# EAGLE design vfd_controller (EAGLE 9.2.2)

## Sheet 1 of 3
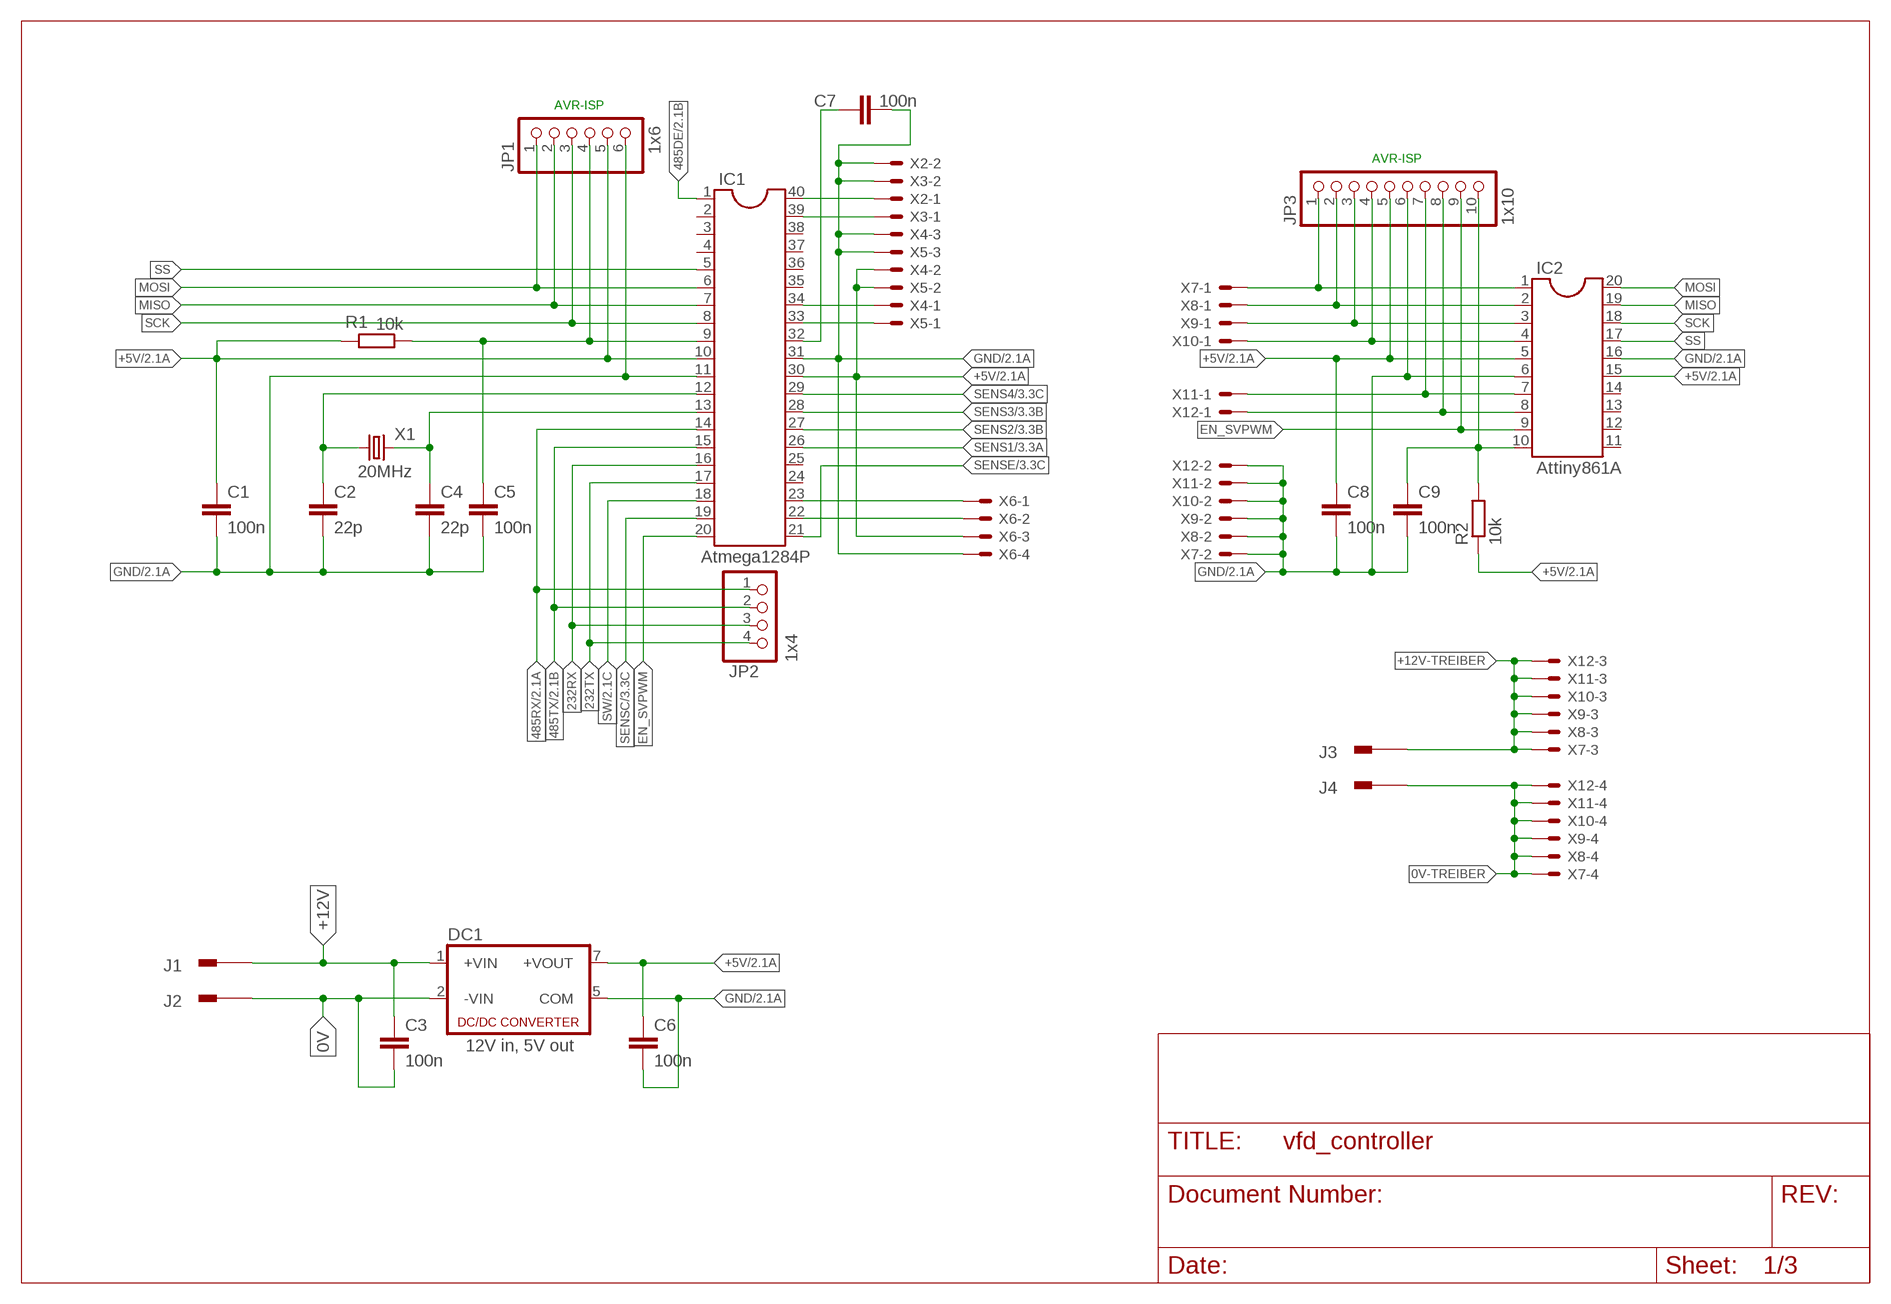
[diagram p0: schematic, sheet 1]

### Parts
C1  100n  C-EU025-024X044  [C025-024X044]
C2  22p  C-EU025-024X044  [C025-024X044]
C3  100n  C-EU025-024X044  [C025-024X044]
C4  22p  C-EU025-024X044  [C025-024X044]
C5  100n  C-EU050-025X075  [C050-025X075]
C6  100n  C-EU050-025X075  [C050-025X075]
C7  100n  C-EU025-024X044  [C025-024X044]
C8  100n  C-EU025-024X044  [C025-024X044]
C9  100n  C-EU025-024X044  [C025-024X044]
DC1  12V in, 5V out  MEV  [MEV]
IC1  Atmega1284P  DIL40  [DIL40]
IC2  Attiny861A  DIL20  [DIL20]
J1  PIN2F061.200  [F061.200]
J2  PIN2F061.200  [F061.200]
J3  PIN2F061.200  [F061.200]
J4  PIN2F061.200  [F061.200]
JP1  1x6  PINHD-1X6  [1X06]
JP2  1x4  PINHD-1X4  [1X04]
JP3  1x10  PINHD-1X10  [1X10]
R1  10k  R-EU_0204/2V  [0204V]
R2  10k  R-EU_0207/12  [0207/12]
X1  20MHz  CRYSTALS-NOGND-HC49  [HC49]
X2  JST-XH-02-PIN-LONG-PAD  [JST-XH-02-PACKAGE-LONG-PAD]
X3  JST-XH-02-PIN-LONG-PAD  [JST-XH-02-PACKAGE-LONG-PAD]
X4  JST-XH-03-PIN-LONG-PAD  [JST-XH-03-PACKAGE-LONG-PAD]
X5  JST-XH-03-PIN-LONG-PAD  [JST-XH-03-PACKAGE-LONG-PAD]
X6  JST-XH-04-PIN-LONG-PAD  [JST-XH-04-PACKAGE-LONG-PAD]
X7  JST-XH-04-PIN-LONG-PAD  [JST-XH-04-PACKAGE-LONG-PAD]
X8  JST-XH-04-PIN-LONG-PAD  [JST-XH-04-PACKAGE-LONG-PAD]
X9  JST-XH-04-PIN-LONG-PAD  [JST-XH-04-PACKAGE-LONG-PAD]
X10  JST-XH-04-PIN-LONG-PAD  [JST-XH-04-PACKAGE-LONG-PAD]
X11  JST-XH-04-PIN-LONG-PAD  [JST-XH-04-PACKAGE-LONG-PAD]
X12  JST-XH-04-PIN-LONG-PAD  [JST-XH-04-PACKAGE-LONG-PAD]

### Nets
0V: C3.2 DC1.2(-VIN) J2.1A J2.1B
0V-TREIBER: J4.1A J4.1B X7.4 X8.4 X9.4 X10.4 X11.4 X12.4
232RX: IC1.16 JP2.3
232TX: IC1.17 JP2.4
485DE: IC1.1 ; also sheet 2
485RX: IC1.14 JP2.1 ; also sheet 2
485TX: IC1.15 JP2.2 ; also sheet 2
+5V: C1.1 C6.1 C8.1 DC1.7(+VOUT) IC1.10 IC1.30 IC2.5 IC2.15 JP1.5 JP3.5 R1.2 R2.1 X4.2 X5.2 X6.3 ; also sheet 2,3
+12V: C3.1 DC1.1(+VIN) J1.1A J1.1B
+12V-TREIBER: J3.1A J3.1B X7.3 X8.3 X9.3 X10.3 X11.3 X12.3
EN_SVPWM: IC1.20 IC2.9 JP3.9
GND: C1.2 C2.2 C4.2 C5.2 C6.2 C7.2 C8.2 C9.2 DC1.5(COM) IC1.11 IC1.31 IC2.6 IC2.16 JP1.6 JP3.6 X2.2 X3.2 X4.3 X5.3 X6.4 X7.2 X8.2 X9.2 X10.2 X11.2 X12.2 ; also sheet 2,3
H1: IC2.1 JP3.1 X7.1
H2: IC2.3 JP3.3 X9.1
H3: IC2.7 JP3.7 X11.1
L1: IC2.2 JP3.2 X8.1
L2: IC2.4 JP3.4 X10.1
L3: IC2.8 JP3.8 X12.1
MISO: IC1.7 IC2.19 JP1.2
MOSI: IC1.6 IC2.20 JP1.1
N$2: IC1.23 X6.1
N$3: IC1.22 X6.2
N$7: IC1.33 X5.1
N$15: IC1.34 X4.1
N$16: C7.1 IC1.32
N$23: IC1.39 X3.1
N$24: IC1.40 X2.1
N$37: C9.1 IC2.10 JP3.10 R2.2
N$41: C5.1 IC1.9 JP1.4 R1.1
N$43: C2.1 IC1.12 X1.1
N$44: C4.1 IC1.13 X1.2
SCK: IC1.8 IC2.18 JP1.3
SENS1: IC1.26 ; also sheet 3
SENS2: IC1.27 ; also sheet 3
SENS3: IC1.28 ; also sheet 3
SENS4: IC1.29 ; also sheet 3
SENSC: IC1.19 ; also sheet 3
SENSE: IC1.21 ; also sheet 3
SS: IC1.5 IC2.17
SW: IC1.18 ; also sheet 2
Unconnected: IC1.2 IC1.3 IC1.4 IC1.24 IC1.25 IC1.35 IC1.36 IC1.37 IC1.38 IC2.11 IC2.12 IC2.13 IC2.14

### Notes on the sheet
- AVR-ISP
- AVR-ISP

## Sheet 2 of 3
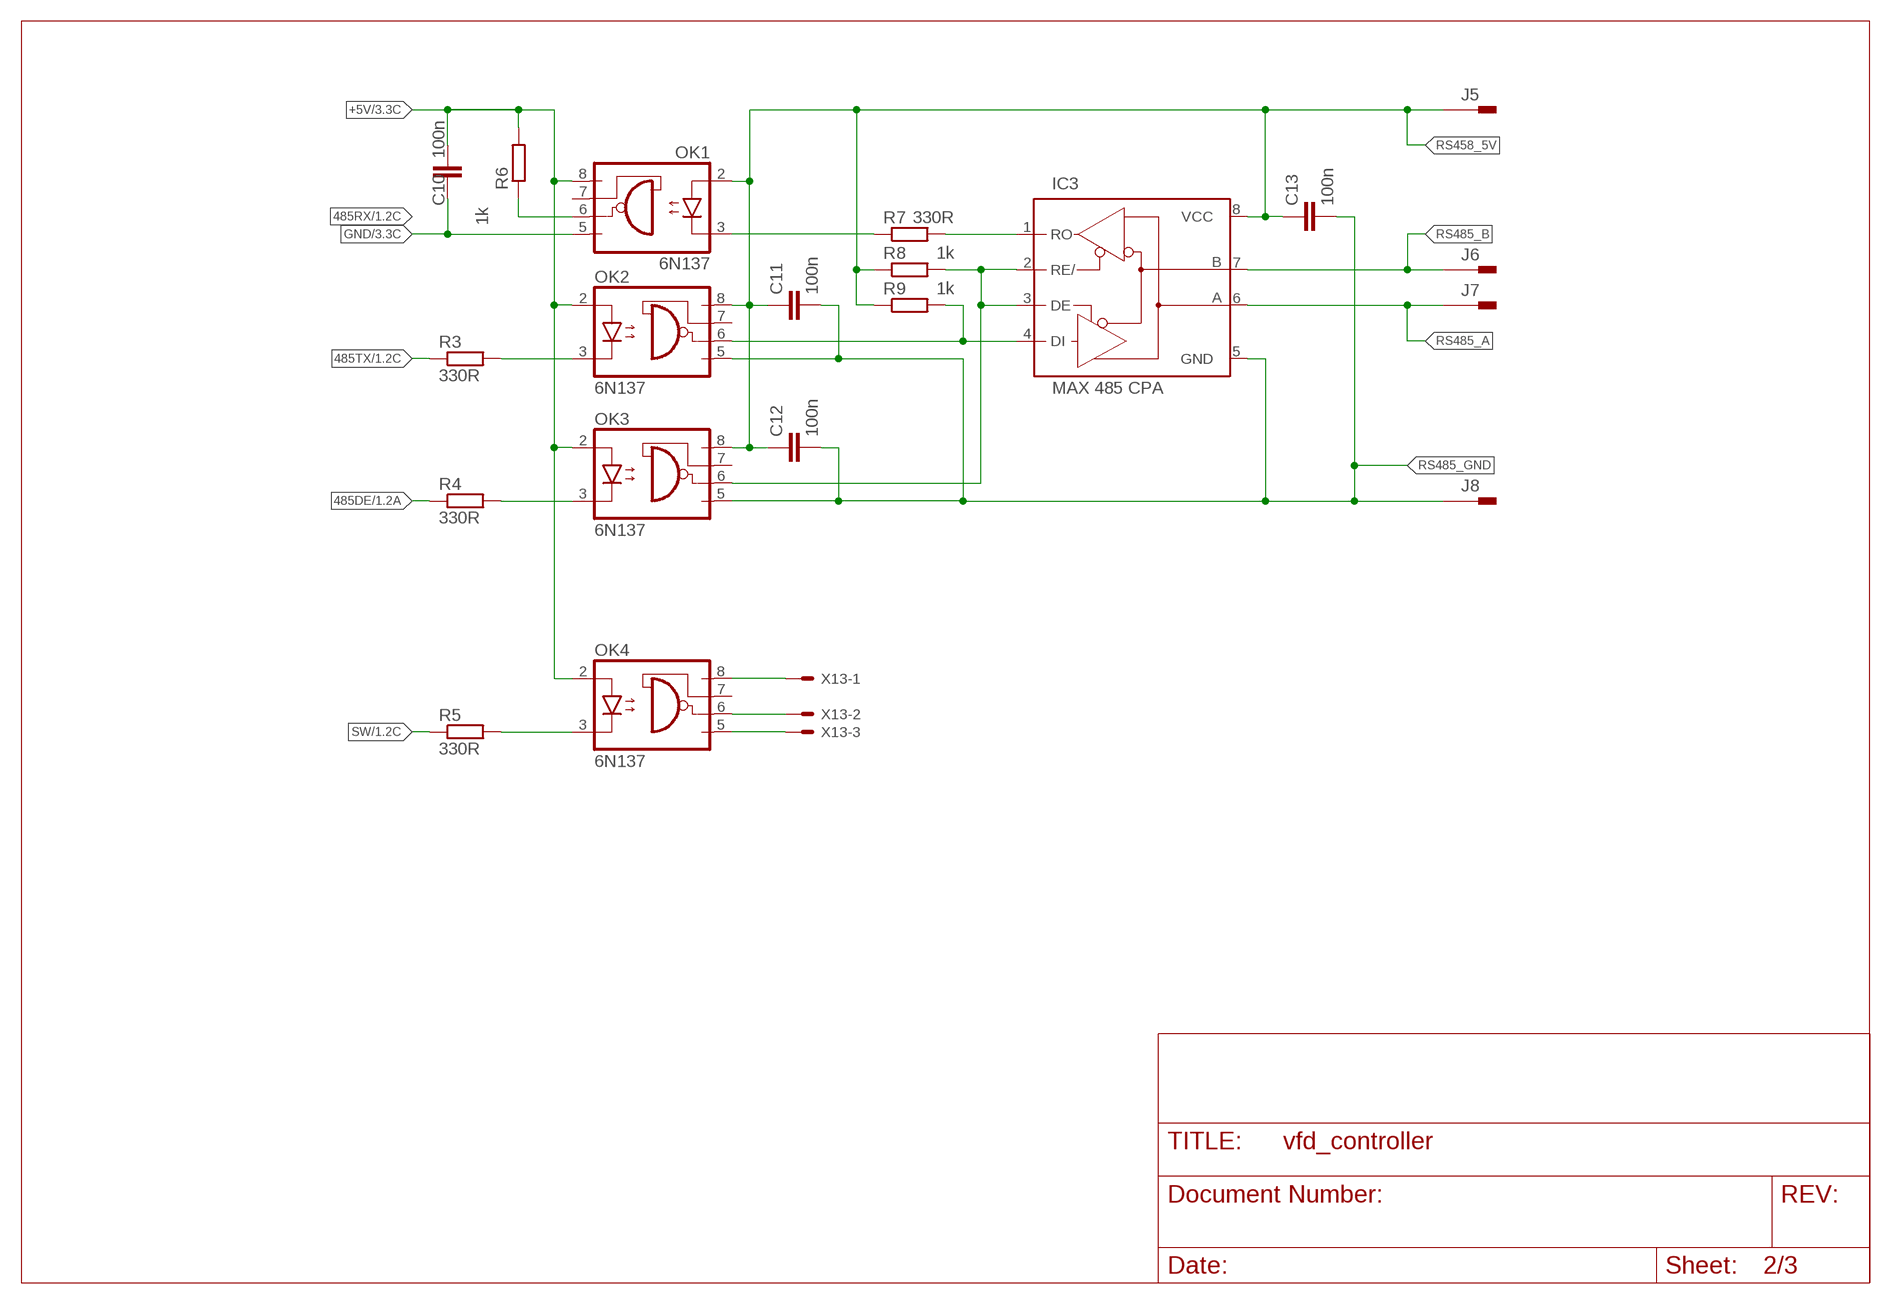
[diagram p1: schematic, sheet 2]

### Parts
C10  100n  C-EU025-024X044  [C025-024X044]
C11  100n  C-EU025-024X044  [C025-024X044]
C12  100n  C-EU025-024X044  [C025-024X044]
C13  100n  C-EU025-024X044  [C025-024X044]
IC3  MAX 485 CPA  MAX3468CPA  [DIL08]
J5  PIN2F061.200  [F061.200]
J6  PIN2F061.200  [F061.200]
J7  PIN2F061.200  [F061.200]
J8  PIN2F061.200  [F061.200]
OK1  6N137  [DIL08]
OK2  6N137  [DIL08]
OK3  6N137  [DIL08]
OK4  6N137  [DIL08]
R3  330R  R-EU_0204/7  [0204/7]
R4  330R  R-EU_0204/7  [0204/7]
R5  330R  R-EU_0207/12  [0207/12]
R6  1k  R-EU_0204/5  [0204/5]
R7  330R  R-EU_0204/5  [0204/5]
R8  1k  R-EU_0204/5  [0204/5]
R9  1k  R-EU_0204/5  [0204/5]
X13  JST-XH-03-PIN-LONG-PAD  [JST-XH-03-PACKAGE-LONG-PAD]

### Nets
485DE: R4.1 ; also sheet 1
485RX: OK1.6(VO) R6.1 ; also sheet 1
485TX: R3.1 ; also sheet 1
+5V: C10.2 OK1.8(VCC) OK2.2(A) OK3.2(A) OK4.2(A) R6.2 ; also sheet 1,3
GND: C10.1 OK1.5(GND) ; also sheet 1,3
N$6: IC3.2(RE/) IC3.3(DE) OK3.6(VO) R8.2
N$8: IC3.1(RO) R7.2
N$9: OK1.3(C) R7.1
N$10: IC3.4(DI) OK2.6(VO) R9.2
N$11: OK3.3(C) R4.2
N$12: OK2.3(C) R3.2
N$33: OK4.3(C) R5.2
N$39: OK4.5(GND) X13.3
N$40: OK4.6(VO) X13.2
N$42: OK4.8(VCC) X13.1
RS458_5V: C11.1 C12.1 C13.1 IC3.8(VCC) J5.1A J5.1B OK1.2(A) OK2.8(VCC) OK3.8(VCC) R8.1 R9.1
RS485_A: IC3.6(A) J7.1A J7.1B
RS485_B: IC3.7(B) J6.1A J6.1B
RS485_GND: C11.2 C12.2 C13.2 IC3.5(GND) J8.1A J8.1B OK2.5(GND) OK3.5(GND)
SW: R5.1 ; also sheet 1
Unconnected: OK1.7(VE) OK2.7(VE) OK3.7(VE) OK4.7(VE)

## Sheet 3 of 3
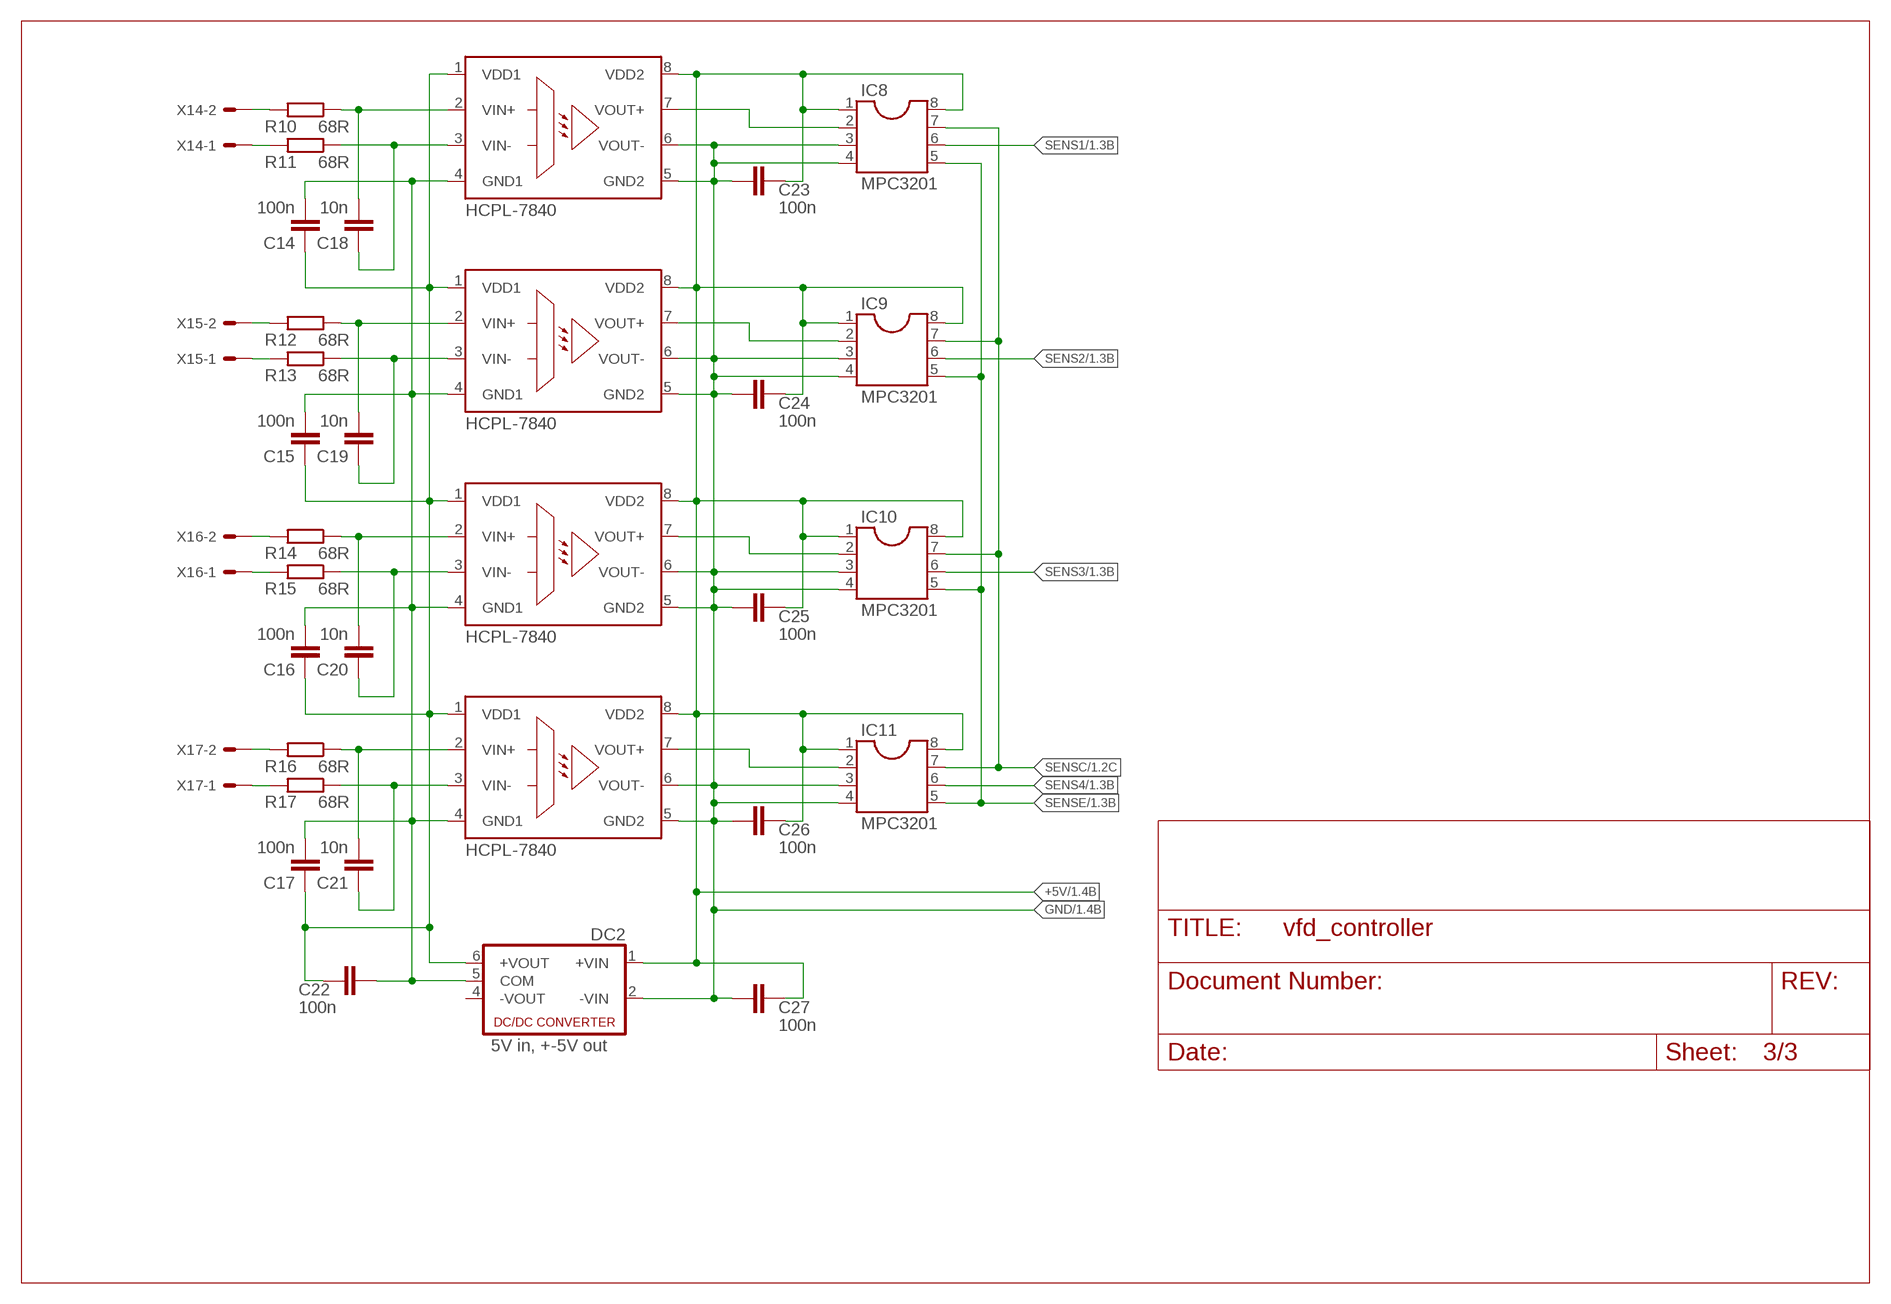
[diagram p2: schematic, sheet 3]

### Parts
C14  100n  C-EU025-024X044  [C025-024X044]
C15  100n  C-EU050-025X075  [C050-025X075]
C16  100n  C-EU050-025X075  [C050-025X075]
C17  100n  C-EU050-025X075  [C050-025X075]
C18  10n  C-EU025-024X044  [C025-024X044]
C19  10n  C-EU025-024X044  [C025-024X044]
C20  10n  C-EU025-024X044  [C025-024X044]
C21  10n  C-EU025-024X044  [C025-024X044]
C22  100n  C-EU025-024X044  [C025-024X044]
C23  100n  C-EU025-024X044  [C025-024X044]
C24  100n  C-EU050-025X075  [C050-025X075]
C25  100n  C-EU050-025X075  [C050-025X075]
C26  100n  C-EU050-025X075  [C050-025X075]
C27  100n  C-EU025-024X044  [C025-024X044]
DC2  5V in, +-5V out  NMA  [NMA]
IC4  HCPL-7840  HCPL-7800  [DIL08]
IC5  HCPL-7840  HCPL-7800  [DIL08]
IC6  HCPL-7840  HCPL-7800  [DIL08]
IC7  HCPL-7840  HCPL-7800  [DIL08]
IC8  MPC3201  DIL8  [DIL08]
IC9  MPC3201  DIL8  [DIL08]
IC10  MPC3201  DIL8  [DIL08]
IC11  MPC3201  DIL8  [DIL08]
R10  68R  R-EU_0204/5  [0204/5]
R11  68R  R-EU_0204/5  [0204/5]
R12  68R  R-EU_0204/5  [0204/5]
R13  68R  R-EU_0204/5  [0204/5]
R14  68R  R-EU_0204/5  [0204/5]
R15  68R  R-EU_0204/5  [0204/5]
R16  68R  R-EU_0204/5  [0204/5]
R17  68R  R-EU_0204/5  [0204/5]
X14  JST-XH-02-PIN-LONG-PAD  [JST-XH-02-PACKAGE-LONG-PAD]
X15  JST-XH-02-PIN-LONG-PAD  [JST-XH-02-PACKAGE-LONG-PAD]
X16  JST-XH-02-PIN-LONG-PAD  [JST-XH-02-PACKAGE-LONG-PAD]
X17  JST-XH-02-PIN-LONG-PAD  [JST-XH-02-PACKAGE-LONG-PAD]

### Nets
+5V: C23.2 C24.2 C25.2 C26.2 C27.2 DC2.1(+VIN) IC4.8(VDD2) IC5.8(VDD2) IC6.8(VDD2) IC7.8(VDD2) IC8.1 IC8.8 IC9.1 IC9.8 IC10.1 IC10.8 IC11.1 IC11.8 ; also sheet 1,2
GND: C23.1 C24.1 C25.1 C26.1 C27.1 DC2.2(-VIN) IC4.5(GND2) IC4.6(VOUT-) IC5.5(GND2) IC5.6(VOUT-) IC6.5(GND2) IC6.6(VOUT-) IC7.5(GND2) IC7.6(VOUT-) IC8.3 IC8.4 IC9.3 IC9.4 IC10.3 IC10.4 IC11.3 IC11.4 ; also sheet 1,2
N$4: R17.2 X17.1
N$5: R16.2 X17.2
N$13: R15.2 X16.1
N$14: R14.2 X16.2
N$17: R13.2 X15.1
N$18: C14.2 C15.2 C16.2 C17.2 C22.1 DC2.5(COM) IC4.4(GND1) IC5.4(GND1) IC6.4(GND1) IC7.4(GND1)
N$19: R12.2 X15.2
N$20: C18.2 IC4.2(VIN+) R10.1
N$21: C19.2 IC5.2(VIN+) R12.1
N$22: C19.1 IC5.3(VIN-) R13.1
N$25: C20.2 IC6.2(VIN+) R14.1
N$26: C20.1 IC6.3(VIN-) R15.1
N$27: C21.2 IC7.2(VIN+) R16.1
N$28: C21.1 IC7.3(VIN-) R17.1
N$29: C14.1 C15.1 C16.1 C17.1 C22.2 DC2.6(+VOUT) IC4.1(VDD1) IC5.1(VDD1) IC6.1(VDD1) IC7.1(VDD1)
N$30: C18.1 IC4.3(VIN-) R11.1
N$31: IC4.7(VOUT+) IC8.2
N$32: IC5.7(VOUT+) IC9.2
N$34: IC6.7(VOUT+) IC10.2
N$35: IC7.7(VOUT+) IC11.2
N$36: R11.2 X14.1
N$38: R10.2 X14.2
SENS1: IC8.6 ; also sheet 1
SENS2: IC9.6 ; also sheet 1
SENS3: IC10.6 ; also sheet 1
SENS4: IC11.6 ; also sheet 1
SENSC: IC8.7 IC9.7 IC10.7 IC11.7 ; also sheet 1
SENSE: IC8.5 IC9.5 IC10.5 IC11.5 ; also sheet 1
Unconnected: DC2.4(-VOUT)

## Library data of the parts
C1 C3 C7-C9 C14 C22 C23 C27 = rcl:C-EU: CAPACITOR, European symbol; R: MKS02-63 100N; SPICEPREFIX: C
C2 C4 = rcl:C-EU: CAPACITOR, European symbol; R: KERKO 22p; SPICEPREFIX: C
C5 C6 C15-C17 C24-C26 = rcl:C-EU: CAPACITOR, European symbol; R: MKS2-63 100N; SPICEPREFIX: C
C10-C13 = resistor:C-EU: CAPACITOR, European symbol; R: MKS02-63 100N
C18-C21 = rcl:C-EU: CAPACITOR, European symbol; R: MKS02-63 10N; SPICEPREFIX: C
DC1 = custom:MEV: DC-DC CONVERTER; R: MEV1S1205SC
DC2 = dc-dc-converter:NMA: DC-DC CONVERTER; MF: C & D TECHNOLOGIES, INC; MPN: NMA0515SC; OC_FARNELL: 1021434; OC_NEWARK: 61K3064; R: MEA1D0505SC
IC1 = ic-package:DIL40: Dual In Line; R: ATMEGA 1284-P-PU
IC2 = ic-package:DIL20: Dual In Line / Socket; R: ATTINY 861A-PU
IC3 = maxim:MAX34*: +5V, Fail-Safe, 40Mbps, Profibus RS-485/RS-422 Transceivers Source: MAX3465-MAX3469.pdf; OC_FARNELL: unknown; OC_NEWARK: unknown; R: MAX 485 CPA
IC4-IC7 = avago:HCPL-7800: Isolation Amplifer Source: http://www.avagotech.com/docs/AV02-0410EN; MPN: HCPL-7800A#500; OC_FARNELL: 459446; OC_NEWARK: 05M6395
IC8-IC11 = ic-package:DIL8: Dual In Line / Socket; R: MPC 3201-CI/P
J1-J8 = con-faston:PIN2: Flachstecker Typ Tyco/Electronics/AMP TAB, FASTON Printed Circuit Board Tabs Source: http://www.buerklin.com, http://catalog.tycoelectronics.com; OC_FARNELL: unknown; OC_NEWARK: unknown; R: FS-PW-6,35
JP1 = pinhead:PINHD-1X6: PIN HEADER; R: MPE 087-1-006
JP2 = pinhead:PINHD-1X4: PIN HEADER; R: MPE 087-1-004
JP3 = pinhead:PINHD-1X10: PIN HEADER; R: MPE 087-1-010
OK1-OK4 = optocoupler:6N137: MOTOROLA OPTO COUPLER; MPN: 6N137; OC_FARNELL: 1328376; OC_NEWARK: 52M1895; R: 6N 137
R1 R2 = rcl:R-EU_: RESISTOR, European symbol; R: METALL 10,0K; SPICEPREFIX: R
R3-R5 R7 = resistor:R-EU_: RESISTOR, European symbol; R: METALL 330
R6 R8 R9 = resistor:R-EU_: RESISTOR, European symbol; R: METALL 1,00K
R10-R17 = resistor:R-EU_: RESISTOR, European symbol; R: METALL 68,0
X1 = IQD-Frequency-Products:CRYSTALS-NOGND: CRYSTALS CAN NOT GROUNDED; R: 20,0000-HC49U-S
X2 X3 X14-X17 =  JST_XH_connnectors:JST-XH-02-PIN: JST XH Connector 2 Pin Wire to board connector. Pitch: 2,54 mm, (0.100") Number of pins: 2 Created by Rembrandt Electronics www.rembrandtelectronics.com; R: JST XH2P ST
X4 X5 X13 =  JST_XH_connnectors:JST-XH-03-PIN: JST XH Connector 2 Pin Wire to board connector. Pitch: 2,54 mm, (0.100") Number of pins: 3 Created by Rembrandt Electronics www.rembrandtelectronics.com; R: JST XH3P ST
X6-X12 =  JST_XH_connnectors:JST-XH-04-PIN: JST XH Connector 2 Pin Wire to board connector. Pitch: 2,54 mm, (0.100") Number of pins: 4 Created by Rembrandt Electronics www.rembrandtelectronics.com; R: JST XH4P ST

## Board
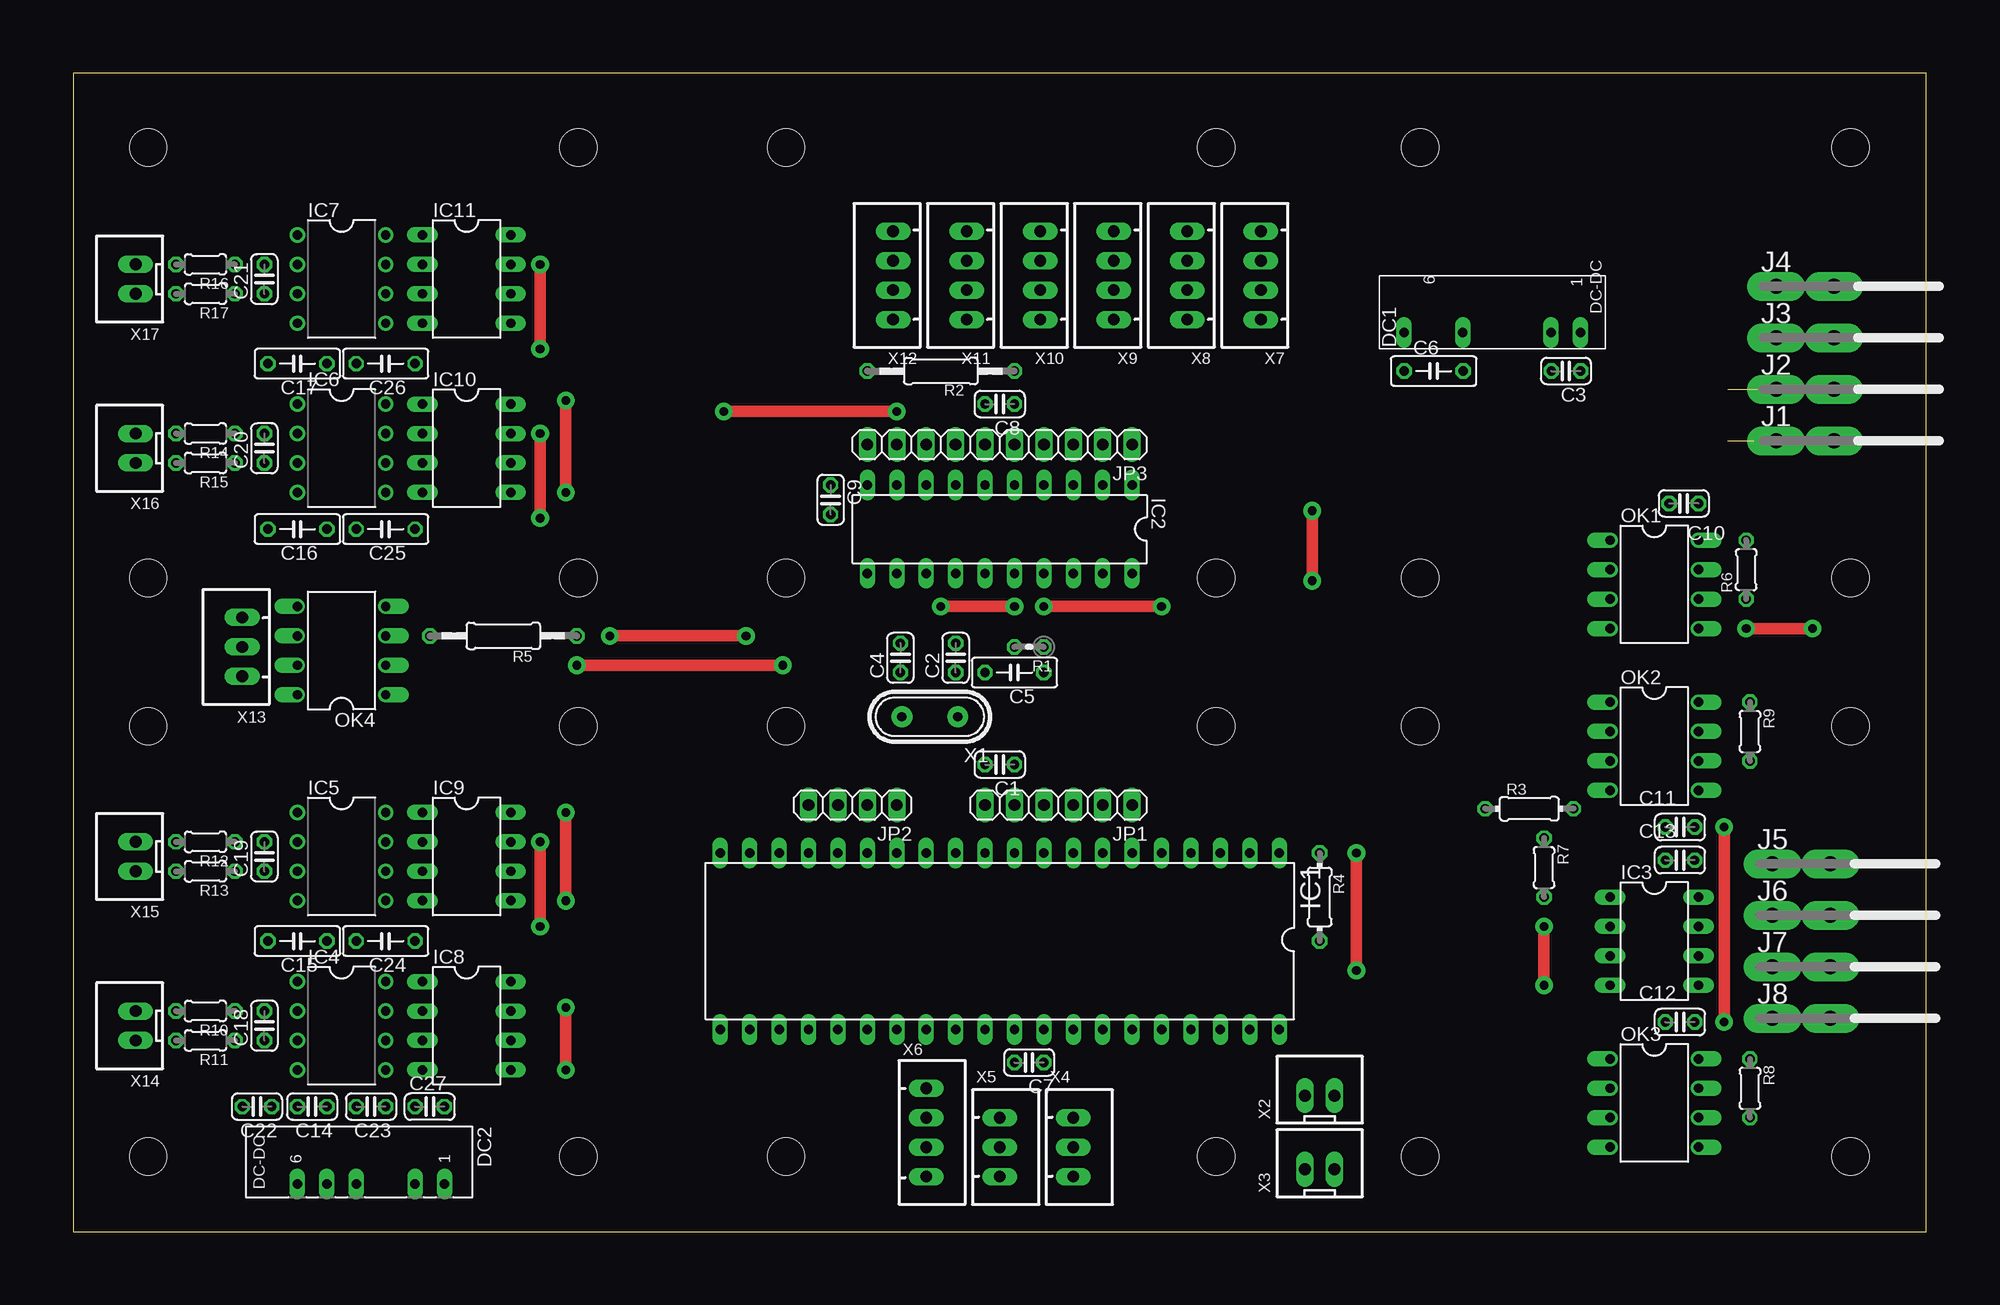
[diagram p3: board, top side]
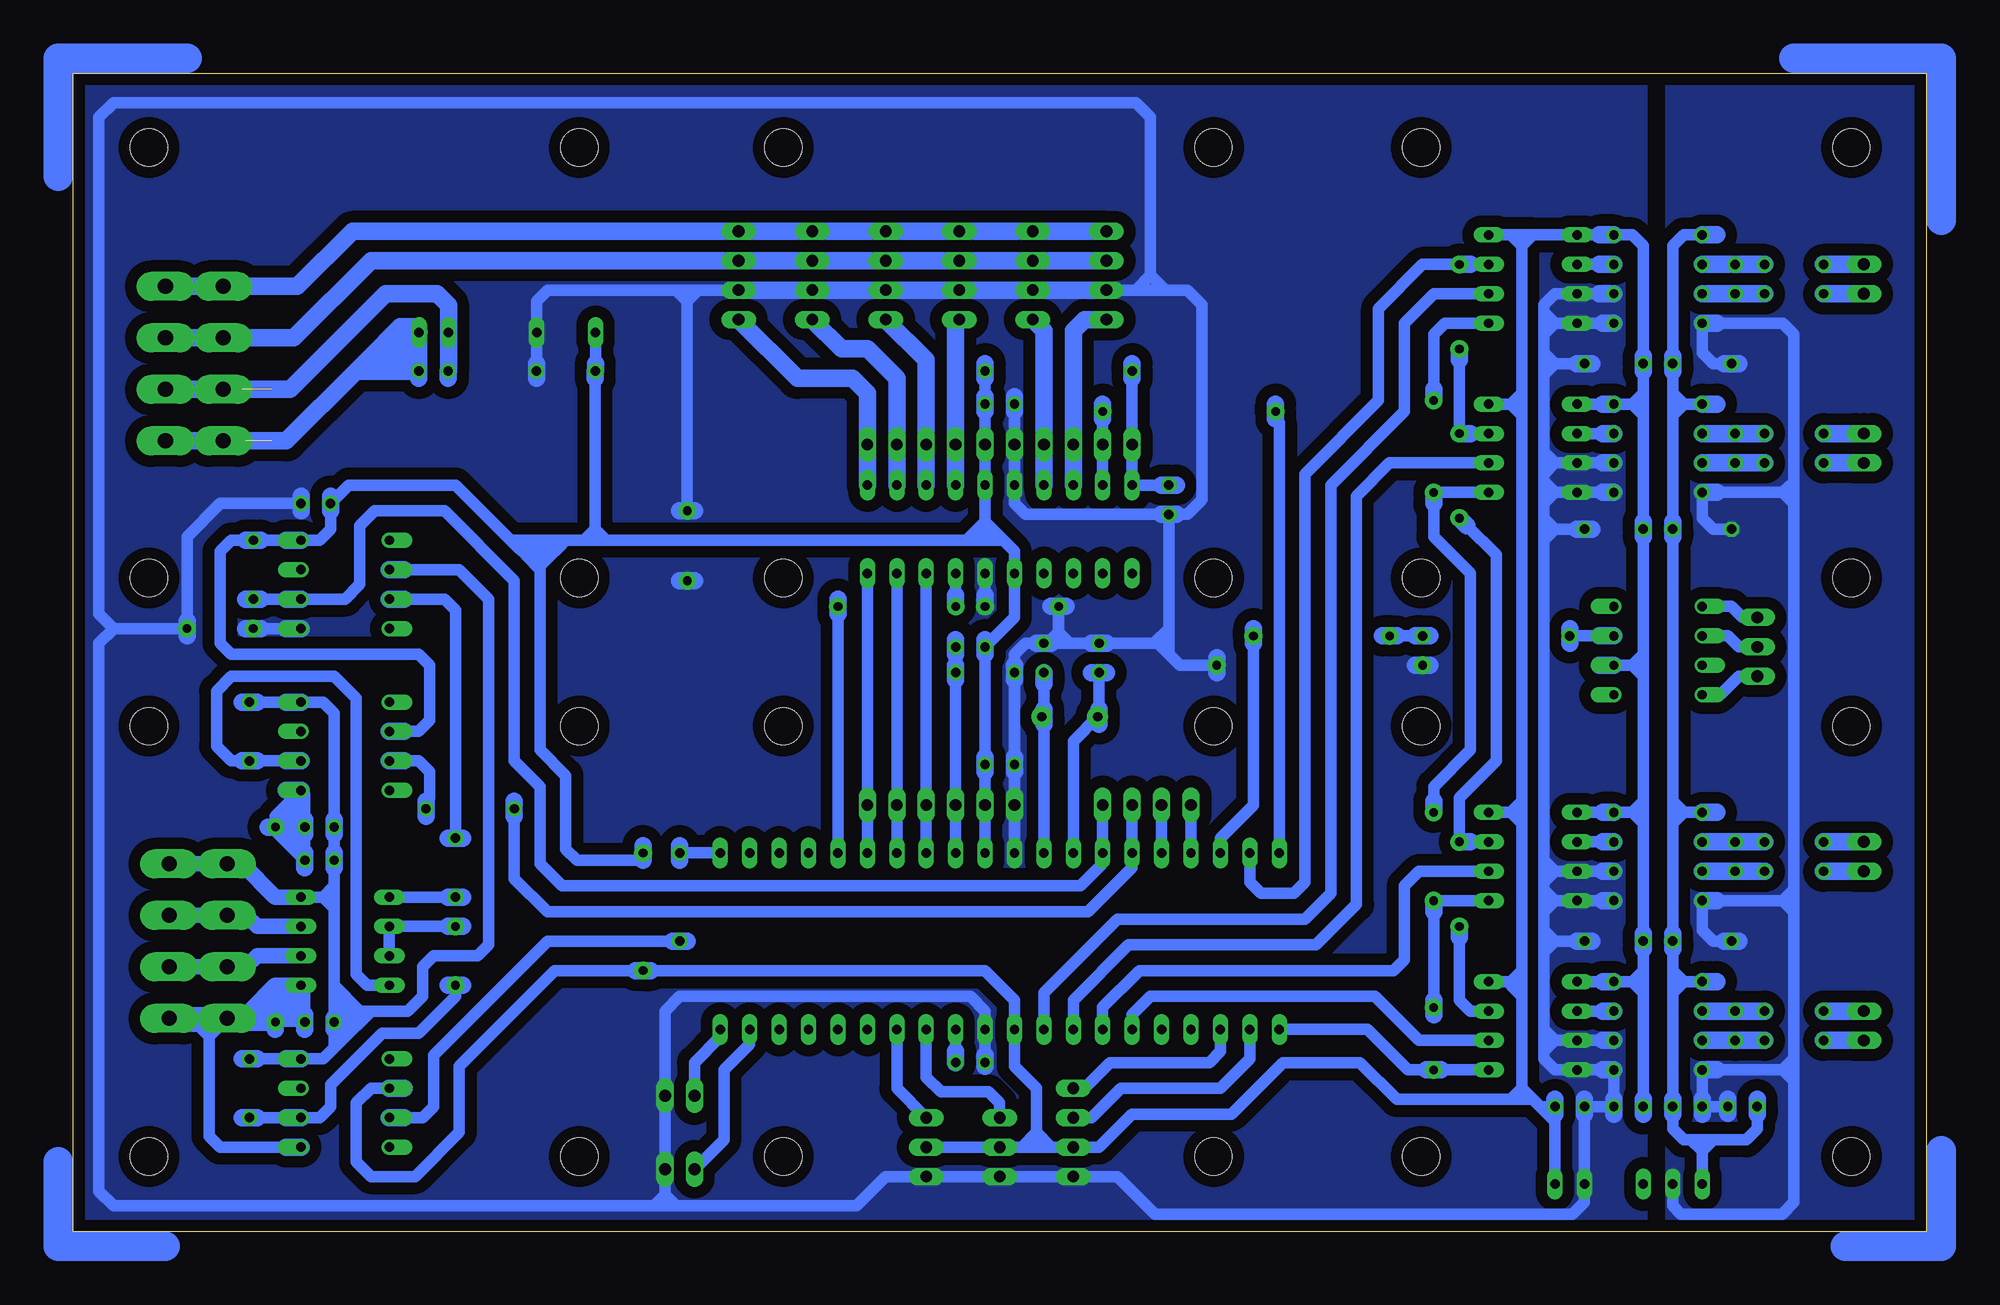
[diagram p4: board, bottom side, seen from below]

Size 160 x 100 mm. Coordinates in mm from the lower left corner, seen from the top.
Outline: 0,0 160,0 160,100 0,100 0,0
Copper layers (1*16): Top 0.035mm / dielectric 1.5mm / Bottom 0.035mm
Design rules "default": minimum track width 6mil, minimum drill 0.35mm, track to track 6mil, track to pad 6mil, pad to pad 6mil, via to via 6mil, smd to smd 6mil, copper to edge 40mil, drill to drill 6mil, minimum pad ring 10mil, minimum via ring 8mil, stop-mask expansion 4mil, vias tented up to drill 0mil, thermal gap 10mil
Holes 3.2 mm at 6.48,93.58 6.48,56.44 43.62,93.58 43.62,56.44 6.48,43.64 6.48,6.5 43.62,43.64 43.62,6.5 116.31,93.58 116.31,56.44 153.46,93.58 153.46,56.44 116.31,43.64 116.31,6.5 153.46,43.64 153.46,6.5 61.55,93.58 61.55,56.44 98.7,93.58 98.7,56.44 61.55,43.64 61.55,6.5 98.7,43.64 98.7,6.5
Milling: 2 lines

### Footprints (pad centres in the part's own frame; a part is rotated, then mirrored left to right if it is on the bottom)
C025-024X044 = drill 0.813 octagon: 1 -1.27,0; 2 1.27,0
C050-025X075 = drill 0.813 octagon: 1 -2.54,0; 2 2.54,0
MEV = drill 0.813 long: 1 -3.683,-6.756; 2 -3.683,-4.216; 5 -3.683,3.404; 7 -3.683,8.484
NMA = drill 0.813 long: 1 0,6.35; 2 0,3.81; 4 0,-1.27; 5 0,-3.81; 6 0,-6.35
DIL40 = drill 0.813 long: 1 -24.13,-7.62; 2 -21.59,-7.62; 3 -19.05,-7.62; 4 -16.51,-7.62; 5 -13.97,-7.62; 6 -11.43,-7.62; 7 -8.89,-7.62; 8 -6.35,-7.62; 9 -3.81,-7.62; 10 -1.27,-7.62; 11 1.27,-7.62; 12 3.81,-7.62; 13 6.35,-7.62; 14 8.89,-7.62; 15 11.43,-7.62; 16 13.97,-7.62; 17 16.51,-7.62; 18 19.05,-7.62; 19 21.59,-7.62; 20 24.13,-7.62; 21 24.13,7.62; 22 21.59,7.62; 23 19.05,7.62; 24 16.51,7.62; 25 13.97,7.62; 26 11.43,7.62; 27 8.89,7.62; 28 6.35,7.62; 29 3.81,7.62; 30 1.27,7.62; 31 -1.27,7.62; 32 -3.81,7.62; 33 -6.35,7.62; 34 -8.89,7.62; 35 -11.43,7.62; 36 -13.97,7.62; 37 -16.51,7.62; 38 -19.05,7.62; 39 -21.59,7.62; 40 -24.13,7.62
DIL20 = drill 0.813 long: 1 -11.43,-3.81; 2 -8.89,-3.81; 3 -6.35,-3.81; 4 -3.81,-3.81; 5 -1.27,-3.81; 6 1.27,-3.81; 7 3.81,-3.81; 8 6.35,-3.81; 9 8.89,-3.81; 10 11.43,-3.81; 11 11.43,3.81; 12 8.89,3.81; 13 6.35,3.81; 14 3.81,3.81; 15 1.27,3.81; 16 -1.27,3.81; 17 -3.81,3.81; 18 -6.35,3.81; 19 -8.89,3.81; 20 -11.43,3.81
DIL08 = drill 0.813 long: 1 -3.81,-3.81; 2 -1.27,-3.81; 3 1.27,-3.81; 4 3.81,-3.81; 5 3.81,3.81; 6 1.27,3.81; 7 -1.27,3.81; 8 -3.81,3.81
DIL08' = drill 0.813 pad 1.3: 1 -3.81,-3.81; 2 -1.27,-3.81; 3 1.27,-3.81; 4 3.81,-3.81; 5 3.81,3.81; 6 1.27,3.81; 7 -1.27,3.81; 8 -3.81,3.81
F061.200 = drill 1.3 pad 2.5 long: 1A -2.5,0; 1B 2.5,0
1X06 = drill 1.016 long: 1 -6.35,0; 2 -3.81,0; 3 -1.27,0; 4 1.27,0; 5 3.81,0; 6 6.35,0
1X04 = drill 1.016 long: 1 -3.81,0; 2 -1.27,0; 3 1.27,0; 4 3.81,0
1X10 = drill 1.016 long: 1 -11.43,0; 2 -8.89,0; 3 -6.35,0; 4 -3.81,0; 5 -1.27,0; 6 1.27,0; 7 3.81,0; 8 6.35,0; 9 8.89,0; 10 11.43,0
DIL08'' = drill 0.813 offset: 1 -3.81,-3.81; 2 -1.27,-3.81; 3 1.27,-3.81; 4 3.81,-3.81; 5 3.81,3.81; 6 1.27,3.81; 7 -1.27,3.81; 8 -3.81,3.81
0204V = drill 0.813 octagon: 1 -1.27,0; 2 1.27,0
0207/12 = drill 0.813 octagon: 1 -6.35,0; 2 6.35,0
0204/7 = drill 0.813 octagon: 1 -3.81,0; 2 3.81,0
0204/5 = drill 0.813 octagon: 1 -2.54,0; 2 2.54,0
HC49 = drill 0.813 pad 1.8: 1 -2.413,0; 2 2.413,0
JST-XH-02-PACKAGE-LONG-PAD = drill 1.016 long: 1 -1.27,0; 2 1.27,0
JST-XH-03-PACKAGE-LONG-PAD = drill 1.016 long: 1 -2.54,0; 2 0,0; 3 2.54,0
JST-XH-04-PACKAGE-LONG-PAD = drill 1.016 long: 1 -3.81,0; 2 -1.27,0; 3 1.27,0; 4 3.81,0

### Placement (x,y rotation side)
C1  80.01,40.32 180 top
C2  76.2,49.53 90 top
C3  128.91,74.3 180 top
C4  71.44,49.53 90 top
C5  81.28,48.26 180 top
C6  117.47,74.3 0 top
C7  82.55,14.61 180 top
C8  80.01,71.44 180 top
C9  65.41,63.18 270 top
C10  139.06,62.87 180 top
C11  138.75,34.92 0 top
C12  138.75,18.1 0 top
C13  138.75,32.07 0 top
C14  20.64,10.79 180 top
C15  19.37,25.08 180 top
C16  19.37,60.64 180 top
C17  19.37,74.93 180 top
C18  16.51,17.78 90 top
C19  16.51,32.38 90 top
C20  16.51,67.63 90 top
C21  16.51,82.23 90 top
C22  15.88,10.79 180 top
C23  25.72,10.79 180 top
C24  26.99,25.08 180 top
C25  26.99,60.64 180 top
C26  26.99,74.93 180 top
C27  30.8,10.79 0 top
DC1  123.39,81.31 90 top
DC2  25.72,4.13 270 top
IC1  80.01,25.08 180 top
IC2  80.01,60.64 180 top
IC3  136.53,25.08 270 top
IC4  HCPL-7840  [DIL08']  23.18,17.78 270 top
IC5  HCPL-7840  [DIL08']  23.18,32.38 270 top
IC6  HCPL-7840  [DIL08']  23.18,67.63 270 top
IC7  HCPL-7840  [DIL08']  23.18,82.23 270 top
IC8  33.97,17.78 270 top
IC9  33.97,32.38 270 top
IC10  33.97,67.63 270 top
IC11  33.97,82.23 270 top
J1  149.54,68.26 0 top
J2  149.54,72.71 0 top
J3  149.54,77.15 0 top
J4  149.54,81.6 0 top
J5  149.22,31.75 0 top
J6  149.22,27.3 0 top
J7  149.22,22.86 0 top
J8  149.22,18.41 0 top
JP1  85.09,36.83 180 top
JP2  67.31,36.83 180 top
JP3  80.01,67.94 180 top
OK1  6N137  [DIL08'']  136.53,55.88 270 top
OK2  6N137  [DIL08'']  136.53,41.91 270 top
OK3  6N137  [DIL08'']  136.53,11.11 270 top
OK4  6N137  [DIL08'']  23.18,50.16 90 top
R1  82.55,50.48 180 top
R2  74.93,74.3 180 top
R3  125.73,36.51 0 top
R4  107.63,28.89 270 top
R5  37.15,51.44 180 top
R6  144.46,57.15 90 top
R7  127,31.43 270 top
R8  144.78,12.38 270 top
R9  144.78,43.18 270 top
R10  11.43,19.05 180 top
R11  11.43,16.51 180 top
R12  11.43,33.66 180 top
R13  11.43,31.11 180 top
R14  11.43,68.9 180 top
R15  11.43,66.36 180 top
R16  11.43,83.5 180 top
R17  11.43,80.96 180 top
U$1  [A4L-LOC]  -51.12,-41.59 0 top  (outside the outline)
X1  73.98,44.45 180 top
X2  107.63,11.75 0 top
X3  107.63,5.4 0 top
X4  86.36,7.3 270 top
X5  80.01,7.3 270 top
X6  73.66,8.57 270 top
X7  102.55,82.55 90 top
X8  96.2,82.55 90 top
X9  89.85,82.55 90 top
X10  83.5,82.55 90 top
X11  77.15,82.55 90 top
X12  70.8,82.55 90 top
X13  14.61,50.48 90 top
X14  5.4,17.78 90 top
X15  5.4,32.38 90 top
X16  5.4,67.63 90 top
X17  5.4,82.23 90 top

### Tracks (layer width: path | path; a pad name or v marks a point on that pad's centre or on a via)
0V
  Bottom 1: 127.61,74.32 C3.2
  Bottom 1.524: J2.1B J2.1A 141.29,72.71 133.03,80.96 128.59,80.96 127.61,79.98 DC1.2 127.61,74.32 | C3.2 127.64,73.66
0V-TREIBER
  Bottom 1.524: X12.4 X11.4 X10.4 X9.4 X8.4 X7.4 135.89,86.36 140.65,81.6 J4.1A J4.1B
232RX
  Bottom 1: IC1.16 JP2.3
232TX
  Bottom 1: IC1.17 JP2.4
485DE
  Bottom 1: IC1.1 R4.1
  Bottom 1.524: 107.63,33.34 R4.1 107.63,32.07
485RX
  Bottom 1: 141.6,54.61 143.83,54.61 | JP2.1 IC1.14 71.12,31.75 73.03,29.84 117.79,29.84 119.7,31.75 119.7,38.42 121.92,40.64 121.92,56.2 127.95,62.23 133.99,62.23 135.25,60.96 135.25,55.88 136.53,54.61 OK1.6
  Bottom 1.524: 143.83,54.61 R6.1 145.1,54.61 | OK1.6 141.6,54.61
485TX
  Bottom 1: JP2.2 IC1.15 68.58,31.43 72.39,27.62 119.06,27.62 121.92,30.48 121.92,35.88
  Bottom 1.524: 121.92,35.88 R3.1 121.92,37.15
+5V  (via drill 0.75 pad 1.52)
  Top 1: v110.81,32.7 v110.81,22.54
  Bottom 1: 27.94,71.44 IC10.1 | 28.26,86.04 IC11.1 33.97,86.04 | 27.94,36.2 IC9.1 | 27.94,21.59 IC8.1 | 34.92,35.24 35.88,36.2 | 35.88,36.2 IC9.8 | 35.88,36.2 34.92,37.15 | 34.92,70.48 35.88,71.44 | 35.88,71.44 IC10.8 | 34.92,37.15 34.92,70.48 | 35.88,71.44 34.92,72.39 | 34.92,85.09 35.88,86.04 | 35.88,86.04 IC11.8 | 34.92,72.39 34.92,85.09 | 34.92,72.39 34.92,70.48 | 34.92,37.15 34.92,35.24 | 34.92,85.09 33.97,86.04 | 33.97,86.04 35.88,86.04 | 24.45,11.43 24.45,20.64 | 24.45,20.64 25.4,21.59 | 25.4,21.59 IC4.8 | 25.4,21.59 24.45,22.54 | 24.45,24.45 24.45,22.54 | 24.45,20.64 24.45,22.54 | 24.45,25.72 24.45,35.24 | 24.45,35.24 25.4,36.2 | 25.4,36.2 IC5.8 | 25.4,36.2 24.45,37.15 | 24.45,37.15 24.45,35.24 | 24.45,61.28 24.45,70.48 | 24.45,70.48 25.4,71.44 | 25.4,71.44 IC6.8 | 25.4,71.44 24.45,72.39 | 24.45,74.3 24.45,72.39 | 24.45,70.48 24.45,72.39 | 24.45,75.56 24.45,85.09 25.4,86.04 IC7.8 | 34.92,22.54 35.88,21.59 | 35.88,21.59 IC8.8 | 34.92,35.24 34.92,22.54 | 35.88,21.59 35.88,21.27 34.92,20.32 | 34.92,12.38 34.92,20.32 | 34.92,20.32 34.92,22.54 | 141.6,59.69 143.83,59.69 | IC1.10 JP1.5 81.28,39.69 | 81.28,70.8 JP3.5 IC2.5 81.28,61.28 | 24.45,60.01 24.45,49.85 | 24.45,49.85 24.45,47.94 | 24.45,47.94 24.45,37.15 | DC2.1 32.07,9.53 | 32.07,10.16 32.07,9.53 | X4.2 X5.2 78.11,7.3 | 78.11,7.3 76.83,7.3 | 76.83,7.3 75.56,7.3 | 75.56,7.3 X6.3 71.44,7.3 68.58,10.16 60.01,10.16 55.56,14.61 48.9,14.61 45.72,11.43 35.88,11.43 | 76.83,7.3 76.83,8.57 | 76.83,8.57 76.83,12.38 78.74,14.29 IC1.30 78.74,20 81.28,22.54 110.17,22.54 | 131.44,43.18 130.18,43.18 129.22,44.13 129.22,48.9 130.18,49.85 146.37,49.85 147.32,50.8 147.32,58.74 146.37,59.69 145.1,59.69 | 137.79,62.23 137.79,60.64 138.75,59.69 OK1.8
  Bottom 1: OK3.2 134.3,12.38 135.57,11.11 135.57,6.03 134.3,4.76 130.49,4.76 126.68,8.57 126.68,14.29 118.43,22.54 111.44,22.54 | 76.83,8.57 75.56,7.3 | 76.83,8.57 78.11,7.3 | 79.69,59.69 78.74,58.74 IC2.15 78.74,53.02 R1.2 | 81.28,40.96 81.28,49.85 | 81.28,73.66 81.28,72.07 | 79.69,59.69 81.28,59.69 | 81.28,59.69 82.87,59.69 | 82.87,59.69 113.98,59.69 | 113.98,59.69 115.89,59.69 | 115.89,59.69 117.47,59.69 | 117.47,59.69 122.24,59.69 | C10.2 136.21,64.45 127,64.45 122.24,59.69 | 81.28,61.28 79.69,59.69 | 81.28,61.28 82.87,59.69 | 81.28,61.28 81.28,59.69 | 122.24,59.69 121.44,58.9 | 121.44,58.9 120.97,58.42 | 120.97,58.42 119.7,57.15 | 119.7,57.15 119.7,41.59 117.47,39.37 117.47,33.02 116.52,32.07 111.44,32.07 v110.81,32.7 | 119.7,57.15 119.7,57.47 118.9,58.26 | 118.9,58.26 118.11,59.05 | 118.11,59.05 117.47,59.69 | 118.11,59.05 121.28,59.05 121.44,58.9 | 120.97,58.42 119.06,58.42 118.9,58.26 | 35.88,11.43 34.92,12.38 | C27.2 33.34,10.79 | 33.34,10.79 33.97,11.43 | 33.97,11.43 34.92,12.38 | 35.88,11.43 33.97,11.43 | 33.34,10.79 32.07,9.53 | OK4.2 25.4,48.9 | 25.4,48.9 24.45,47.94 | 25.4,48.9 24.45,49.85 | DC1.7 114.91,74.93 114.91,74.3 | 114.91,74.3 C6.1 | 114.94,60.64 113.98,59.69 | 114.94,60.64 115.89,59.69 | 114.94,60.64 114.94,73.66 114.94,74.27 114.91,74.3
  Bottom 1.524: IC7.8 28.26,86.04 | IC6.8 27.94,71.44 | IC5.8 27.94,36.2 | IC4.8 27.94,21.59 | 24.45,11.43 C23.2 24.45,10.16 | 32.07,11.43 C27.2 32.07,10.16 | 137.79,62.23 C10.2 137.79,63.5 | 143.83,59.69 R6.2 145.1,59.69 | OK1.8 141.6,59.69 | OK3.2 131.44,12.38 | OK2.2 131.44,43.18 | 110.81,33.34 v110.81,32.7 110.81,32.07 | 110.17,22.54 v110.81,22.54 111.44,22.54 | 81.28,72.07 C8.1 81.28,70.8 | 81.28,73.66 R2.1 81.28,74.93 | 81.28,49.85 R1.2 81.28,51.12 | 81.28,40.96 C1.1 81.28,39.69 | OK4.2 28.26,48.9 | 114.91,74.93 114.91,74.32 C6.1 114.94,73.66 | 24.45,24.45 C24.2 24.45,25.72 | 24.45,61.28 C25.2 24.45,60.01 | 24.45,75.56 C26.2 24.45,74.3
+12V
  Bottom 1: 130.15,74.32 C3.1
  Bottom 1.524: 135.57,74.3 141.6,68.26 J1.1A J1.1B | C3.1 135.57,74.3 | C3.1 130.18,73.66 | C3.1 130.18,75.25 | 130.18,75.25 130.18,77.6 DC1.1 | DC1.1 130.18,77.65 130.18,78.11 131.76,78.11 134.46,75.41 | 134.46,75.41 135.57,74.3 | 134.46,75.41 130.33,75.41 130.18,75.25 | DC1.1 131.57,76.2 132.72,76.2
+12V-TREIBER
  Bottom 1.524: X12.3 X11.3 X10.3 X9.3 X8.3 X7.3 134.3,83.82 140.97,77.15 J3.1A J3.1B
EN_SVPWM  (via drill 0.75 pad 1.52)
  Top 1: v56.2,70.8 v71.12,70.8
  Bottom 1: IC2.9 JP3.9 71.12,70.17 | 56.2,70.17 55.88,69.85 IC1.20
  Bottom 1.524: 56.2,71.44 v56.2,70.8 56.2,70.17 | 71.12,71.44 v71.12,70.8 71.12,70.17
GND  (via drill 0.75 pad 1.52)
  Top 1: v144.46,52.07 v150.18,52.07 | v74.93,53.98 v81.28,53.98 | v107,62.23 v107,56.2 | v61.28,48.9 v43.5,48.9
  Bottom 1: 27.94,66.36 IC10.3 32.07,66.36 | 27.94,63.82 IC10.4 32.07,63.82 | 27.94,78.42 IC11.4 32.07,78.42 | 28.26,80.96 IC11.3 32.07,80.96 33.02,80.01 33.02,79.38 | 27.94,28.57 IC9.4 32.07,28.57 | 27.94,31.11 IC9.3 32.07,31.11 | 27.94,13.97 IC8.4 32.07,13.97 33.02,14.92 33.02,15.56 | 27.94,16.51 IC8.3 32.07,16.51 | 26.99,11.43 IC4.5 | 33.02,27.62 32.07,28.57 | 33.02,15.56 33.02,17.46 | 33.02,17.46 33.02,24.13 | 33.02,24.13 33.02,25.08 | 33.02,25.08 33.02,26.04 | 33.02,26.04 33.02,27.62 | 32.07,28.57 33.02,29.53 | 33.02,29.53 33.02,30.16 | 33.02,30.16 33.02,32.07 | 33.02,62.87 32.07,63.82 | 33.02,32.07 33.02,59.69 | 33.02,59.69 33.02,61.59 | 33.02,61.59 33.02,62.87 | 32.07,63.82 33.02,64.77 | 33.02,77.47 32.07,78.42 | 33.02,64.77 33.02,65.41 | 33.02,65.41 33.02,67.31 | 33.02,67.31 33.02,73.98 | 33.02,73.98 33.02,75.88 | 33.02,75.88 33.02,77.47 | 32.07,16.51 33.02,15.56 | 32.07,16.51 33.02,17.46 | 33.02,27.62 33.02,29.53 | 32.07,31.11 33.02,30.16 | 32.07,31.11 33.02,32.07 | 32.07,66.36 33.02,65.41 | 32.07,66.36 33.02,67.31 | 32.07,78.42 33.02,79.38 | 33.02,77.47 33.02,79.38 | C27.1 C23.1 | IC1.11 JP1.6 78.74,39.69 | 78.74,70.8 JP3.6 IC2.6 78.74,62.87 77.79,61.91 66.04,61.91 | 33.02,64.77 33.02,62.87 | 29.53,10.16 DC2.2 29.53,2.54 30.55,1.52 66.6,1.52 69.85,4.76 X6.4 X5.3 X4.3 89.85,4.76 92.39,2.22 107.95,2.22 | 75.56,50.8 73.98,50.8 | 72.07,50.8 73.98,50.8 | 143.83,52.07 141.6,52.07 | 150.18,52.7 150.18,60.01 147.32,62.87 C10.1 | 156.53,52.07 157.8,50.8 157.8,3.49 156.53,2.22 109.86,2.22 | 156.53,52.07 v150.18,52.07 | 78.74,40.96 78.74,47.62 78.74,48.9 78.74,49.85 77.79,50.8 76.83,50.8 | C9.2 65.41,52.07 | 65.41,52.07 66.67,50.8 | 70.8,50.8 66.67,50.8
  Bottom 1: 64.77,61.91 63.82,61.91 62.55,63.18 62.55,80.01 63.82,81.28 65.72,81.28 | 65.72,81.28 68.26,81.28 | 68.26,81.28 X12.2 | 81.28,54.93 IC2.16 | v74.93,53.98 74.93,51.75 | 74.93,51.75 73.98,50.8 | 74.93,51.75 75.88,50.8 C2.2 | X7.2 106.05,81.28 | 106.05,81.28 107.95,81.28 | 156.53,52.07 157.8,53.34 157.8,96.2 156.53,97.47 68.26,97.47 66.99,96.2 66.99,82.55 | 66.99,82.55 65.72,81.28 | 66.99,82.55 68.26,81.28 | X3.2 X2.2 108.9,19.05 107.63,20.32 82.55,20.32 81.28,19.05 IC1.31 81.28,15.24 | X3.2 108.9,4.13 | 107.95,2.22 109.86,2.22 | X3.2 108.9,3.17 | 108.9,3.17 107.95,2.22 | 108.9,3.17 109.86,2.22 | v107,62.23 107,80.33 | 107,80.33 106.05,81.28 | 107,80.33 107.95,81.28 | v61.28,48.9 64.45,48.9 65.41,49.85 | 66.67,50.8 66.36,50.8 65.41,49.85 | 65.41,52.07 65.41,49.85 | 120.02,74.93 120.02,77.6 | 120.02,77.6 DC1.5 | 107.95,81.28 119.06,81.28 120.02,80.33 120.02,77.6 | 30.16,74.93 32.07,74.93 | 32.07,74.93 33.02,75.88 | 32.07,74.93 33.02,73.98 | 30.16,60.64 32.07,60.64 | 32.07,60.64 33.02,61.59 | 32.07,60.64 33.02,59.69 | 30.16,25.08 32.07,25.08 | 32.07,25.08 33.02,25.08 | 32.07,25.08 33.02,26.04 | 32.07,25.08 33.02,24.13
  Bottom 1.524: X12.2 X11.2 X10.2 X9.2 X8.2 X7.2 | IC7.5 27.94,78.42 | IC7.6 28.26,80.96 | IC6.6 27.94,66.36 | IC6.5 27.94,63.82 | IC5.6 27.94,31.11 | IC5.5 27.94,28.57 | IC4.6 27.94,16.51 | IC4.5 27.94,13.97 | 26.99,11.43 C23.1 26.99,10.16 | 29.53,11.43 C27.1 29.53,10.16 | 140.34,62.23 C10.1 140.34,63.5 | OK1.5 141.6,52.07 | 143.83,52.07 v144.46,52.07 145.1,52.07 | 150.18,52.7 v150.18,52.07 150.18,51.44 | 106.36,56.2 v107,56.2 107.63,56.2 | 106.36,62.23 v107,62.23 107.63,62.23 | 81.28,14.29 81.28,15.24 | 64.77,61.91 C9.2 66.04,61.91 | 78.74,72.07 C8.2 78.74,70.8 | 74.3,53.98 v74.93,53.98 75.56,53.98 | v81.28,53.98 81.28,54.93 | 70.8,50.8 C4.2 72.07,50.8 | 75.56,50.8 C2.2 76.83,50.8 | 78.74,47.62 C5.2 78.74,48.9 | 78.74,40.96 C1.2 78.74,39.69 | 42.86,48.9 v43.5,48.9 44.13,48.9 | 61.28,49.53 v61.28,48.9 61.28,48.26 | 120.02,74.93 C6.2 120.02,73.66 | 30.16,25.08 C24.1 28.89,25.08 | 28.89,60.64 C25.1 30.16,60.64 | 28.89,74.93 C26.1 30.16,74.93
  pour Bottom (isolate 1, no thermals): 24.13,100.01 24.13,0 160.02,0 160.02,100.01
H1
  Bottom 1.524: IC2.1 JP3.1 91.44,72.39 92.71,73.66 97.47,73.66 X7.1
H2
  Bottom 1.524: IC2.3 JP3.3 86.36,75.25 X9.1
H3
  Bottom 1.524: IC2.7 JP3.7 76.2,77.79 X11.1
L1
  Bottom 1.524: IC2.2 JP3.2 88.9,73.66 91.44,76.2 93.66,76.2 X8.1
L2
  Bottom 1.524: IC2.4 JP3.4 83.82,78.42 X10.1
L3
  Bottom 1.524: IC2.8 JP3.8 73.66,77.79 72.71,78.74 X12.1
MISO
  Bottom 1: IC1.7 JP1.2 IC2.19
MOSI
  Bottom 1: IC1.6 JP1.1 IC2.20
N$1
  Bottom 2.54: -1.27,87.31 -1.27,101.28 11.43,101.28
N$2
  Bottom 1: IC1.23 60.96,15.56 61.91,14.61 70.48,14.61 72.71,12.38 X6.1
N$3
  Bottom 1: X6.2 72.07,9.84 69.53,12.38 60.96,12.38 58.42,14.92 IC1.22
N$4
  Bottom 1.524: R17.2 X17.1
N$5
  Bottom 1.524: X17.2 R16.2
N$6  (via drill 0.75 pad 1.52)
  Top 1: v127,26.35 v127,21.27
  Bottom 1: 144.15,9.84 141.6,9.84 | IC3.3 IC3.2 127.64,26.35 | v127,21.27 127,20.32 130.18,17.14 133.35,17.14 137.79,12.7 137.79,10.79 138.75,9.84 OK3.6
  Bottom 1.524: OK3.6 141.6,9.84 | 144.15,9.84 R8.2 145.41,9.84 | 126.36,21.27 v127,21.27 127.64,21.27 | 126.36,26.35 v127,26.35 127.64,26.35
N$7
  Bottom 1: IC1.33 86.36,13.34 85.09,12.06 80.96,12.06 80.01,11.11 X5.1
N$8
  Bottom 1: 127.64,28.89 IC3.1
  Bottom 1.524: 126.36,28.89 R7.2 127.64,28.89
N$9
  Bottom 1: R7.1 127,53.66 127.95,54.61 131.44,54.61
  Bottom 1.524: 126.36,33.97 R7.1 127.64,33.97 | OK1.3 131.44,54.61
N$10
  Bottom 1: IC3.4 134.62,21.27 135.57,22.23 135.57,46.04 137.48,47.94 146.37,47.94 147.64,46.67 147.64,41.91 146.37,40.64 145.41,40.64 | 144.15,40.64 141.6,40.64
  Bottom 1.524: OK2.6 141.6,40.64 | 144.15,40.64 R9.2 145.41,40.64
N$11
  Bottom 1: 108.27,25.08 119.06,25.08 128.91,15.24 128.91,10.79 129.86,9.84 131.44,9.84
  Bottom 1.524: OK3.3 131.44,9.84 | 107,25.08 R4.2 108.27,25.08
N$12
  Bottom 1: 132.08,40.64 OK2.3 | 131.44,40.64 130.18,40.64 129.22,39.69 129.22,37.47 129.54,37.15
  Bottom 1.524: 129.54,35.88 R3.2 129.54,37.15 | OK2.3 131.44,40.64
N$13
  Bottom 1.524: X16.1 R15.2
N$14
  Bottom 1.524: R14.2 X16.2
N$15
  Bottom 1: IC1.34 88.9,12.38 X4.1
N$16
  Bottom 1: 83.82,15.56 IC1.32
  Bottom 1.524: C7.1 83.82,15.56
N$17
  Bottom 1.524: X15.1 R13.2
N$18
  Bottom 1: 19.37,11.43 IC4.4 | 18.1,78.42 12.38,78.42 11.43,77.47 11.43,64.45 | 11.43,64.45 11.43,63.82 | 11.43,63.82 11.43,62.87 | 12.38,28.57 18.1,28.57 | 12.38,28.57 11.43,27.62 | 11.43,14.92 12.38,13.97 | 18.1,13.97 12.38,13.97 | 11.43,27.62 11.43,14.92 | C22.1 C14.2 | 12.38,28.57 11.43,29.53 | 11.43,29.53 11.43,62.87 | DC2.5 21.91,2.22 21.2,1.52 12.45,1.52 11.43,2.54 11.43,13.02 | 11.43,13.02 12.38,13.97 | 11.43,14.92 11.43,13.02 | 17.46,74.93 18.41,74.93 19.37,75.88 IC7.4 | 12.38,63.82 IC6.4 19.37,61.59 18.41,60.64 C16.2 | 12.38,63.82 11.43,63.82 | 12.38,63.82 11.75,64.45 11.43,64.45 | 12.38,63.82 11.43,62.87 | 17.46,25.08 18.41,25.08 19.37,26.04 IC5.4 | 11.43,29.53 11.43,27.62
  Bottom 1.524: 17.14,11.43 C22.1 17.14,10.21 | 19.37,10.16 C14.2 19.37,11.43 | 18.73,63.82 IC6.4 18.1,63.82 | IC4.4 18.1,13.97 | 18.1,28.57 IC5.4 | IC7.4 18.1,78.42 | 16.19,25.08 C15.2 17.46,25.08 | 16.19,74.93 C17.2 17.46,74.93
  pour Bottom (isolate 1, no thermals): 22.54,100.01 22.54,0 0,0 0,100.01
N$19
  Bottom 1.524: R12.2 X15.2
N$20
  Bottom 1.524: IC4.2 C18.2 R10.1
N$21
  Bottom 1.524: R12.1 C19.2 IC5.2
N$22
  Bottom 1.524: IC5.3 C19.1 R13.1
N$23
  Bottom 1: IC1.39 101.6,16.19 103.82,13.97 103.82,7.94 X3.1
N$24
  Bottom 1: IC1.40 104.14,16.83 106.36,14.61 X2.1
N$25
  Bottom 1.524: R14.1 C20.2 IC6.2
N$26
  Bottom 1.524: IC6.3 C20.1 R15.1
N$27
  Bottom 1.524: R16.1 C21.2 IC7.2
N$28
  Bottom 1.524: IC7.3 C21.1 R17.1
N$29
  Bottom 0.813: 21.91,10.16 21.91,9.84 | 14.61,10.16 14.61,9.84
  Bottom 1: 21.91,20.64 20.95,21.59 | 21.91,11.43 21.91,20.64 | 20.95,21.59 21.91,22.54 | 21.91,24.45 21.91,22.54 | 21.91,22.54 21.91,20.64 | 21.91,25.72 21.91,35.24 | 21.91,35.24 20.95,36.2 | 20.95,36.2 21.91,37.15 | 21.91,35.24 21.91,37.15 | 21.91,70.48 20.95,71.44 | 20.95,71.44 21.91,72.39 | 21.91,74.3 21.91,72.39 | 21.91,70.48 21.91,72.39 | 21.91,75.56 21.91,85.09 20.95,86.04 IC7.1 | C22.2 14.61,8.89 15.56,7.94 18.41,7.94 | C14.1 21.91,8.89 20.95,7.94 20.32,7.94 | 18.41,7.94 20.32,7.94 | DC2.6 19.37,6.99 | 19.37,6.99 18.41,7.94 | 19.37,6.99 20.32,7.94 | 20.95,36.2 IC5.1 | 20.95,71.44 IC6.1 | 20.95,21.59 IC4.1 | 21.91,61.28 21.91,70.48 | 21.91,60.01 21.91,37.15
  Bottom 1.524: 18.73,21.59 IC4.1 18.1,21.59 | 14.61,10.16 C22.2 14.61,11.43 | 21.91,10.16 C14.1 21.91,11.43 | IC5.1 18.1,36.2 | IC6.1 18.1,71.44 | IC7.1 18.1,86.04 | 21.91,24.45 C15.1 21.91,25.72 | 21.91,75.56 C17.1 21.91,74.3 | 21.91,61.28 C16.1 21.91,60.01
N$30
  Bottom 1.524: R11.1 C18.1 IC4.3
N$31
  Bottom 1: 27.94,19.05 IC8.2
  Bottom 1.524: IC4.7 27.94,19.05
N$32
  Bottom 1: 27.94,33.66 IC9.2
  Bottom 1.524: IC5.7 27.94,33.66
N$33
  Bottom 1: 28.26,51.44 R5.2
  Bottom 1.524: OK4.3 28.26,51.44 | 30.8,52.07 R5.2 30.8,50.8
N$34
  Bottom 1: 27.94,68.9 IC10.2
  Bottom 1.524: IC6.7 27.94,68.9
N$35
  Bottom 1: 28.26,83.5 IC11.2
  Bottom 1.524: IC7.7 28.26,83.5
N$36
  Bottom 1.524: X14.1 R11.2
N$37
  Bottom 1: 66.04,64.45 IC2.10 JP3.10 68.58,73.66
  Bottom 1.524: 68.58,73.66 R2.2 68.58,74.93 | 64.77,64.45 C9.1 66.04,64.45
N$38
  Bottom 1.524: X14.2 R10.2
N$39
  Bottom 1: X13.3 15.88,53.02 16.83,53.98 OK4.5
N$40
  Bottom 1: X13.2 16.19,50.48 17.14,51.44 OK4.6
N$41
  Bottom 1: IC1.9 JP1.4 83.82,47.62 | 83.82,49.85 83.82,48.9
  Bottom 1.524: 83.82,48.9 C5.1 83.82,47.62 | 83.82,49.85 R1.1 83.82,51.12
N$42
  Bottom 1: X13.1 16.19,47.94 17.78,46.35 OK4.8
N$43
  Bottom 1: 76.2,43.81 IC1.12 | 76.2,45.09 76.2,47.31
  Bottom 1.524: C2.1 76.2,47.31 | 76.2,44.45 76.2,45.09 | X1.1 76.2,44.45 | 76.2,44.45 76.2,43.81
N$44
  Bottom 1: IC1.13 73.66,42.35 X1.2 | 71.44,45.09 C4.1
  Bottom 1.524: 70.8,48.26 C4.1 72.07,48.26 | 71.44,45.09 71.44,44.58 X1.2 71.44,44.32 71.44,43.81
N$45
  Bottom 2.54: 150.18,101.28 161.29,101.28 161.29,91.12
N$46
  Bottom 2.54: 161.29,6.03 161.29,-1.27 152.08,-1.27
N$47
  Bottom 2.54: -1.27,6.99 -1.27,-1.27 6.99,-1.27
RS458_5V
  Bottom 1: 138.43,28.89 137.79,28.89 | 137.48,15.88 137.48,17.46 | 137.48,17.46 137.48,18.41 137.48,20.64 | 137.48,20.64 137.48,21.27 | 137.48,21.27 137.48,27.94 | 137.48,27.94 137.48,29.84 | 138.43,28.89 137.48,29.84 | IC3.8 138.43,28.89 | 138.43,28.89 137.48,27.94 | OK3.8 138.43,14.92 137.48,15.88 | 144.15,14.92 141.6,14.92 | 141.6,45.72 144.15,45.72 | OK2.8 138.43,45.72 137.48,44.77 137.48,35.56 | 137.48,19.05 135.89,19.05 | 135.89,19.05 135.25,19.05 | 135.25,19.05 134.3,19.05 | 134.3,19.05 131.13,19.05 129.86,20.32 129.86,22.86 128.91,23.81 125.09,23.81 124.14,24.77 124.14,54.61 126.68,57.15 131.44,57.15 | 135.89,19.05 137.48,17.46 | 135.89,19.05 137.48,20.64 | 137.48,21.27 135.25,19.05 | 137.48,15.88 137,16.35 | 137,16.35 134.3,19.05 | 137,16.35 137,17.3 135.25,19.05 | 137.48,31.43 137.48,29.84 | 137.48,32.7 137.48,34.29
  Bottom 1.321: IC3.8 142.56,28.89 145.41,31.75 J5.1A J5.1B
  Bottom 1.524: 144.15,45.72 R9.1 145.41,45.72 | OK2.8 141.6,45.72 | 137.48,35.56 C11.1 137.48,34.29 | 137.48,32.7 C13.1 137.48,31.43 | 137.48,18.41 C12.1 137.48,17.46 | OK3.8 141.6,14.92 | 144.15,14.92 R8.1 145.41,14.92 | OK1.2 131.44,57.15
RS485_A
  Bottom 1.321: IC3.6 144.15,23.81 145.1,22.86 J7.1A J7.1B
RS485_B
  Bottom 1.321: IC3.7 144.15,26.35 145.1,27.3 J6.1A J6.1B
RS485_GND  (via drill 0.75 pad 1.52)
  Top 1: v142.56,34.92 v142.56,18.1
  Bottom 0.762: 144.78,19.05 151.09,19.05 J8.1B | J8.1B 151.09,17.78 | J8.1B 149.22,18.41 | 142.56,19.37 140.65,19.37 | 140.65,19.37 140.02,19.37 | 140.97,20.32 140.65,20 140.65,19.37 | J8.1B 150.95,17.64 147.5,17.64
  Bottom 1: IC3.5 140.02,20.95 140.02,19.37 140.02,18.73 | 145.41,18.41 145.1,18.41 | 141.92,34.92 C11.2 | 140.02,32.7 140.02,34.29 | 140.02,37.78 OK2.5 142.56,35.88 v142.56,34.92 | 140.02,37.78 140.02,35.56 141.92,35.56 v142.56,34.92 | C13.2 142.56,34.61 v142.56,34.92 | v142.56,34.92 141.29,33.66 140.65,33.66 140.65,33.97 140.97,34.29 | 140.02,37.78 141.29,36.51 141.29,36.2 140.65,36.2 | OK3.5 147.32,7.3 148.27,8.26 148.27,16.87 | 148.27,16.87 147.5,17.64 J8.1A | 148.27,16.87 149.82,18.41 J8.1B
  Bottom 1.27: 141.29,20 arc90 140.97,20.32 142.24,20.32 142.56,20 | 142.56,20 144.15,18.41 145.1,18.41 J8.1A | 142.56,18.73 142.56,19.37 142.56,20
  Bottom 1.321: IC3.5 142.56,21.27 144.78,19.05 145.41,18.41 J8.1A 148.59,18.41
  Bottom 1.524: OK2.5 141.6,38.1 | 140.02,35.56 C11.2 140.02,34.29 | 140.02,32.7 C13.2 140.02,31.43 | 141.92,34.92 v142.56,34.92 143.19,34.92 | 140.02,17.46 C12.2 140.02,18.73 140.34,18.41 144.15,18.41 | v142.56,18.1 142.56,17.46 | v142.56,18.1 142.56,18.73 | v142.56,18.1 146.41,18.1 J8.1A | OK3.5 141.6,7.3
SCK
  Bottom 1: IC1.8 JP1.3 IC2.18
SENS1
  Bottom 1: IC1.26 68.58,18.73 66.99,20.32 47.62,20.32 43.81,16.51 IC8.6
SENS2
  Bottom 1: IC1.27 71.12,19.37 67.94,22.54 46.04,22.54 45.09,23.5 45.09,29.84 43.81,31.11 IC9.6
SENS3
  Bottom 1: IC1.28 73.66,20 68.9,24.77 52.7,24.77 49.21,28.26 49.21,63.5 46.35,66.36 IC10.6
SENS4
  Bottom 1: IC1.29 76.2,20.64 69.85,26.99 53.66,26.99 51.44,29.21 51.44,64.45 45.09,70.8 45.09,78.42 42.55,80.96 IC11.6
SENSC  (via drill 0.75 pad 1.52)
  Top 1: v40.32,26.35 v40.32,33.66 | v40.32,61.59 v40.32,68.9 | v40.32,76.2 v40.32,83.5
  Bottom 1: IC8.7 39.37,19.05 40.32,20 40.32,25.4 | 39.37,33.66 IC9.7 | v40.32,33.66 40.32,37.47 37.15,40.64 37.15,58.42 39.69,60.96 | 39.37,68.9 IC10.7 | 40.32,75.25 v40.32,68.9 | 39.37,83.5 IC11.7 | v40.32,83.5 43.5,83.5 47.31,79.69 47.31,71.75 53.66,65.41 53.66,30.16 54.61,29.21 57.47,29.21 58.42,30.16 IC1.19
  Bottom 1.524: v40.32,26.35 40.32,25.4 | v40.32,33.66 39.37,33.66 | v40.32,61.59 39.69,60.96 | v40.32,68.9 39.37,68.9 | v40.32,76.2 40.32,75.25 | v40.32,83.5 39.37,83.5
SENSE  (via drill 0.75 pad 1.52)
  Top 1: v42.55,13.97 v42.55,19.37 | v42.55,28.57 v42.55,36.2 | v42.55,63.82 v42.55,71.75
  Bottom 1: IC1.21 48.26,17.46 44.77,13.97 43.18,13.97 | 42.55,27.62 42.55,20 | v42.55,28.57 IC9.5 | 42.55,37.15 42.55,38.42 39.37,41.59 39.37,56.83 42.55,60.01 42.55,62.87 | v42.55,63.82 IC10.5 | 42.55,72.71 42.55,77.47 41.59,78.42 IC11.5 | 41.91,13.97 IC8.5
  Bottom 1.524: 41.91,13.97 v42.55,13.97 43.18,13.97 | 42.55,18.73 v42.55,19.37 42.55,20 | v42.55,28.57 42.55,27.62 | v42.55,36.2 42.55,37.15 | v42.55,63.82 42.55,62.87 | v42.55,71.75 42.55,72.71
SS  (via drill 0.75 pad 1.52)
  Top 1: v93.98,53.98 v83.82,53.98
  Bottom 1: 83.82,54.93 IC2.17 | 93.98,53.34 IC1.5
  Bottom 1.524: v83.82,53.98 83.82,54.93 | 93.98,54.61 v93.98,53.98 93.98,53.34
SW  (via drill 0.75 pad 1.52)
  Top 1: v46.35,51.44 v58.1,51.44
  Bottom 1: IC1.18 60.96,33.97 58.1,36.83 58.1,50.8 | 44.13,51.44 v46.35,51.44
  Bottom 1.524: 58.1,52.07 v58.1,51.44 58.1,50.8 | 46.99,51.44 v46.35,51.44 45.72,51.44 | 42.86,51.44 R5.1 44.13,51.44
(copper drawn outside any net)
  shapes: Bottom circle x24

### Text on the board
Document: Variable Frequency Drive | VFD-Conroller | (C) 2019 Christoph Klie | [1/1] | Version 1.0